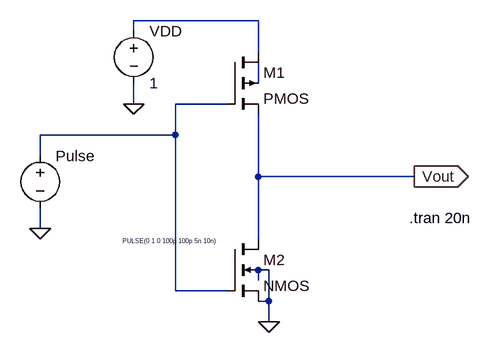
[diagram p0: schematic CMOS_LTspice.asc]
CMOS_LTspice.asc, the LTspice schematic file:
Version 4.1
SHEET 1 880 680
WIRE 32 80 -160 80
WIRE -160 96 -160 80
WIRE 32 128 32 80
WIRE 32 176 32 144
WIRE -160 208 -160 176
WIRE -16 208 -96 208
WIRE -96 256 -96 208
WIRE -96 256 -304 256
WIRE -304 288 -304 256
WIRE 32 320 32 224
WIRE 272 320 32 320
WIRE -304 400 -304 368
WIRE 32 416 32 320
WIRE 48 464 32 464
WIRE 32 480 32 464
WIRE -96 496 -96 256
WIRE -16 496 -96 496
WIRE 48 512 48 464
WIRE 48 512 32 512
WIRE 48 544 48 512
FLAG -160 208 0
FLAG -304 400 0
FLAG 48 544 0
FLAG 272 320 Vout
IOPIN 272 320 Out
SYMBOL voltage -304 272 R0
WINDOW 3 127 147 Left 0
WINDOW 123 0 0 Left 0
WINDOW 39 0 0 Left 0
SYMATTR InstName Pulse
SYMATTR Value PULSE(0 1 0 100p 100p 5n 10n)
SYMBOL voltage -160 80 R0
WINDOW 123 0 0 Left 0
WINDOW 39 0 0 Left 0
SYMATTR InstName VDD
SYMATTR Value 1
SYMBOL nmos4 -16 416 R0
SYMATTR InstName M2
SYMATTR Value2 l=180n w=400n
SYMBOL pmos4 -16 128 R0
SYMATTR InstName M1
SYMATTR Value2 l=180n w=800n
TEXT 264 384 Left 2 !.tran 20n

The netlist it stands for:
* CMOS_LTspice.asc
V§Pulse N003 0 PULSE(0 1 0 100p 100p 5n 10n)
VDD N001 0 1
M2 Vout N003 0 0 NMOS l=180n w=400n
M1 N001 N003 Vout N002 PMOS l=180n w=800n
.model NMOS NMOS
.model PMOS PMOS
.lib standard.mos
.tran 20n
.backanno
.end